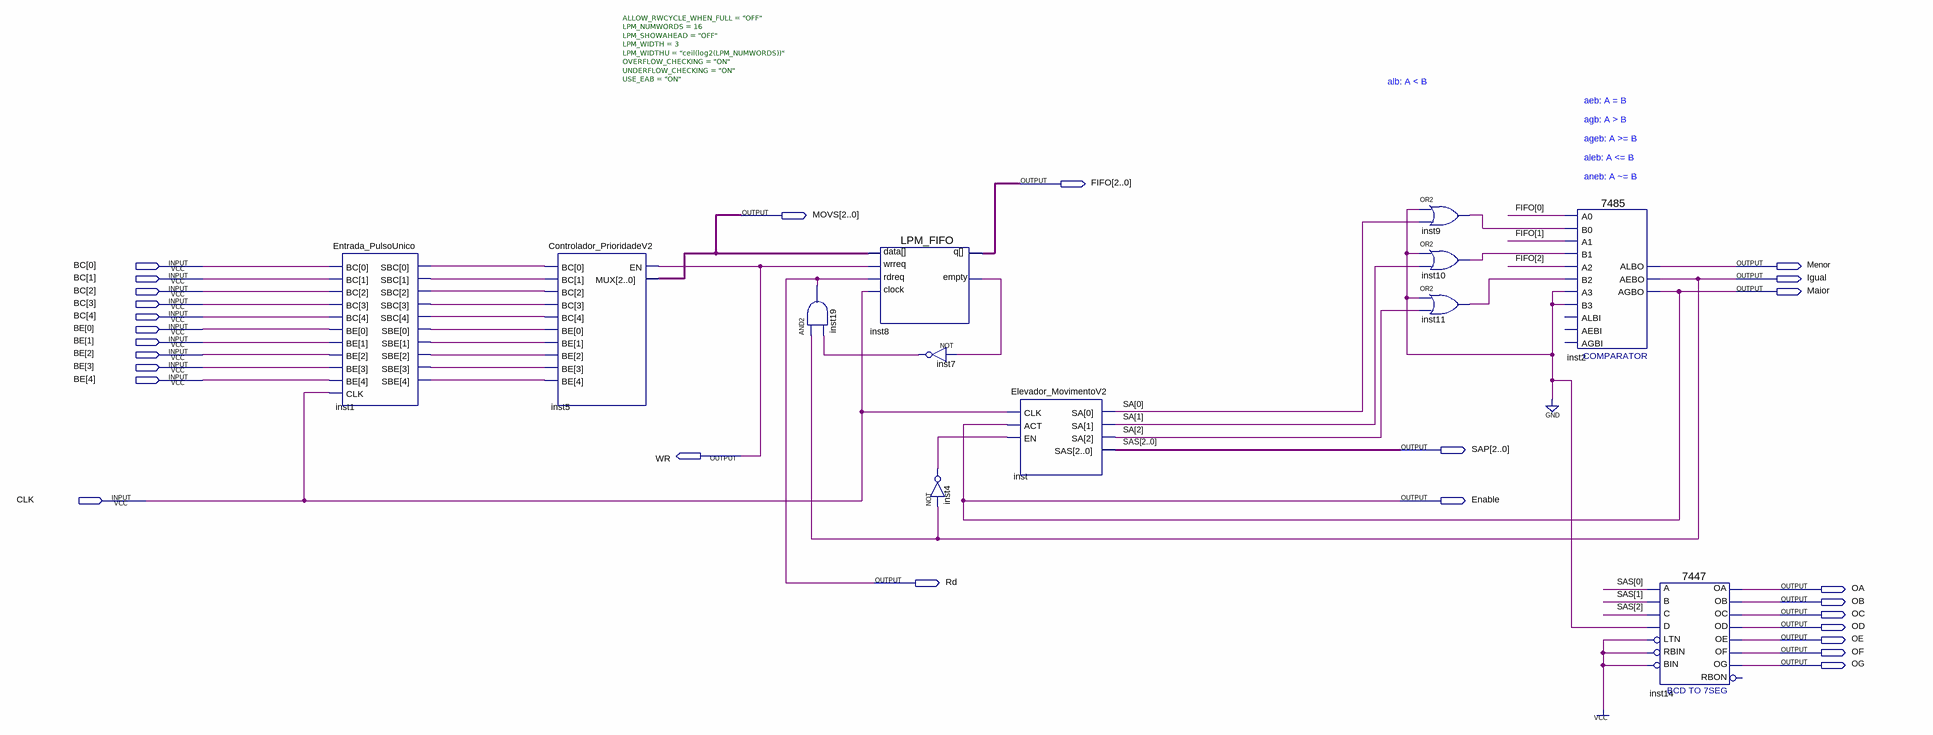
[diagram p0: schematic sheet]
// Quartus schematic ElevadorBetaV3.bdf as structural Verilog: 12 symbols, 27 pins
module ElevadorBetaV3 (
  input  [4:0] BC,
  input  [4:0] BE,
  input  CLK,
  output [2:0] FIFO,
  output [2:0] MOVS,
  output Menor,
  output Igual,
  output Maior,
  output [2:0] SAP,
  output WR,
  output Enable,
  output Rd,
  output OA,
  output OB,
  output OC,
  output OD,
  output OE,
  output OF,
  output OG
);

  wire inst1_sbc, inst1_sbc_2, inst1_sbc_3, inst1_sbc_4, inst1_sbc_5, inst1_sbe, inst1_sbe_2, inst1_sbe_3,
       inst1_sbe_4, inst1_sbe_5, inst4_out, inst7_out, inst8_empty, inst9_out, inst10_out, inst11_out;
  wire [2:0] SA;

  Entrada_PulsoUnico inst1 (
    .BC(BC), .BE(BE), .CLK(CLK), .SBC({inst1_sbc_5, inst1_sbc_4, inst1_sbc_3, inst1_sbc_2, inst1_sbc}),
    .SBE({inst1_sbe_5, inst1_sbe_4, inst1_sbe_3, inst1_sbe_2, inst1_sbe}));
  Controlador_PrioridadeV2 inst5 (
    .BC({inst1_sbc_5, inst1_sbc_4, inst1_sbc_3, inst1_sbc_2, inst1_sbc}),
    .BE({inst1_sbe_5, inst1_sbe_4, inst1_sbe_3, inst1_sbe_2, inst1_sbe}), .EN(WR), .MUX(MOVS));
  and inst19 (Rd, Igual, inst7_out);
  LPM_FIFO #(.ALLOW_RWCYCLE_WHEN_FULL("OFF"), .LPM_NUMWORDS(16), .LPM_SHOWAHEAD("OFF"), .LPM_WIDTH(3), .LPM_WIDTHU("ceil(log2(LPM_NUMWORDS))"), .OVERFLOW_CHECKING("ON"), .UNDERFLOW_CHECKING("ON"), .USE_EAB("ON")) inst8 (
    .clock(CLK), .data(MOVS), .rdreq(Rd), .wrreq(WR), .empty(inst8_empty), .q(FIFO));
  not inst7 (inst7_out, inst8_empty);
  not inst4 (inst4_out, Igual);
  Elevador_MovimentoV2 inst (.CLK(CLK), .ACT(Enable), .EN(inst4_out), .SA(SA), .SAS(SAP));
  or inst9 (inst9_out, 1'b0, SA[0]);
  or inst10 (inst10_out, 1'b0, SA[1]);
  or inst11 (inst11_out, 1'b0, SA[2]);
  \7485  inst2 (
    .A3(1'b0), .B2(inst11_out), .A2(FIFO[2]), .A0(FIFO[0]), .B0(inst9_out), .B3(1'b0), .A1(FIFO[1]),
    .B1(inst10_out), .ALBO(Menor), .AGBO(Enable), .AEBO(Igual));  // open: AEBI, AGBI, ALBI
  \7447  inst14 (
    .LTN(1'b1), .B(SAP[1]), .C(SAP[2]), .D(1'b0), .RBIN(1'b1), .BIN(1'b1), .A(SAP[0]), .OB(OB), .OC(OC),
    .OE(OE), .OD(OD), .OF(OF), .OG(OG), .OA(OA));  // open: RBON

  assign Maior = Enable;

  // Other names for the same wires on the sheet: SAS[2:0] = SAP

  // Notes on the sheet:
  //   alb: A < B
  //   aeb: A = B
  //   agb: A > B
  //   ageb: A >= B
  //   aleb: A <= B
  //   aneb: A ~= B
endmodule
